# Altium schematic sheet rf_router_swrmet.SchDoc: mcHF Pro Transceiver RF board
size A3; Author: Krassi Atanassov; CompanyName: MØNKA; Engineer: For radio amateurs experimentation, non-commercial use only. Thank you!; Revision: 0.8.2; SheetTotal: 14
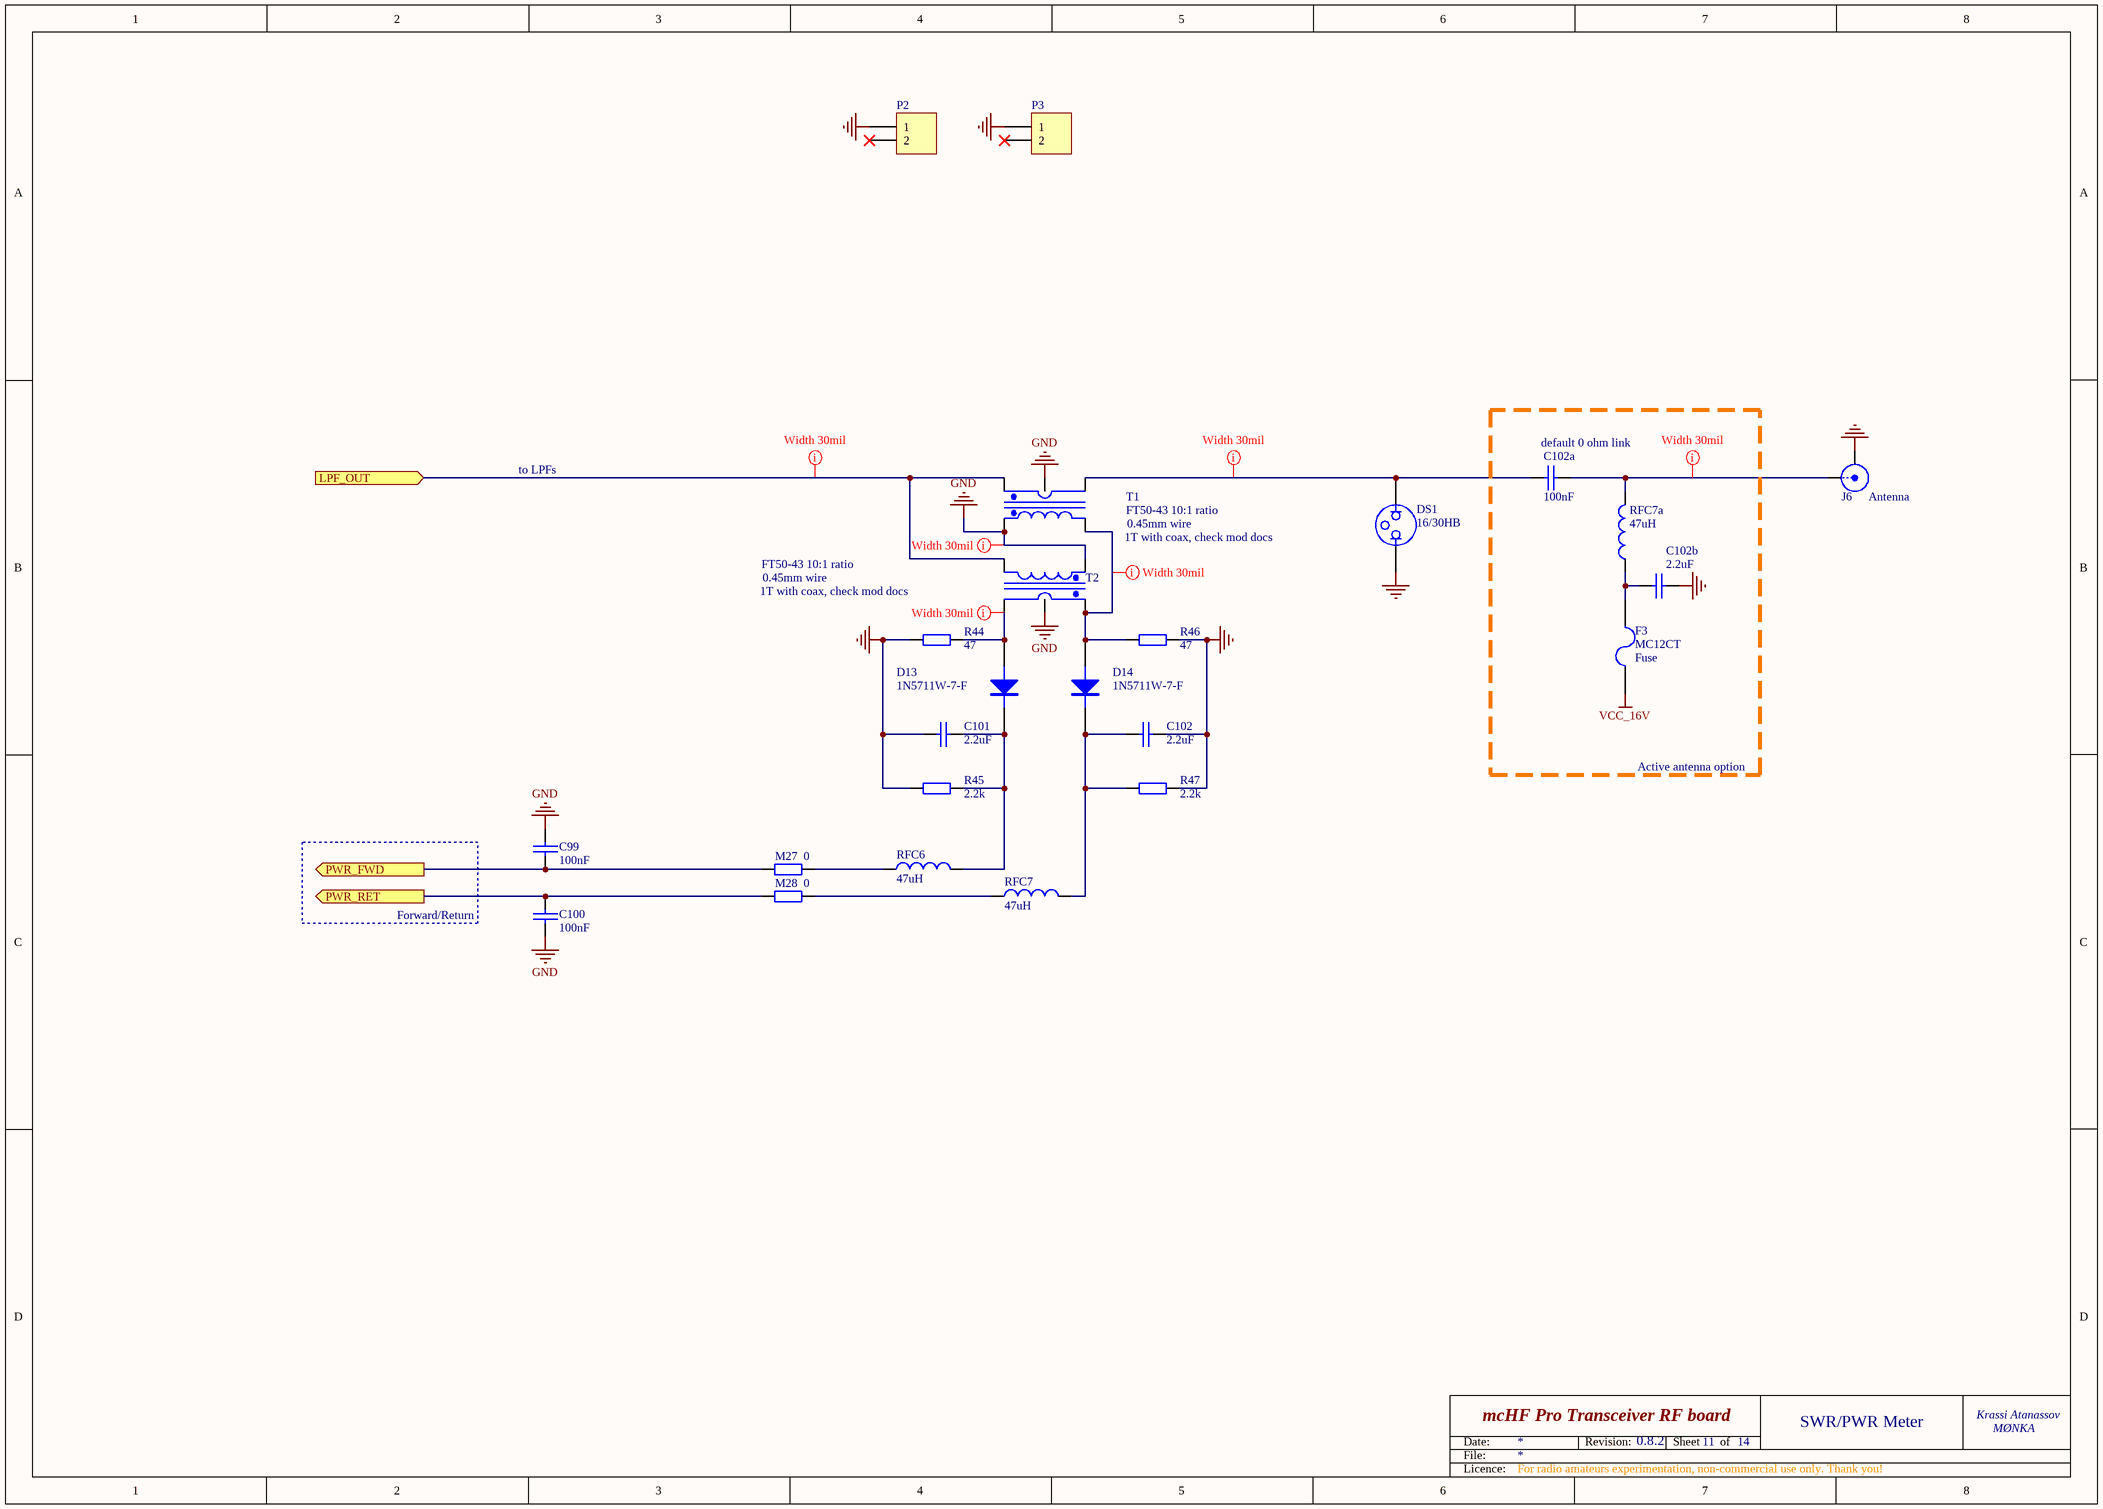
[diagram p0: rf_router_swrmet.SchDoc]

## Parts
C99  100nF  [0805]
C100  100nF  [0805]
C101  2.2uF  [0805]
C102  2.2uF  [0805]
C102a  100nF  [0805]  (no BOM)
C102b  2.2uF  [0805]  (no BOM)
D13  1N5711W-7-F  [SOD87]
D14  1N5711W-7-F  [SOD87]
DS1  16/30HB  [NEON]
F3  MC12CT  [1206]  (no BOM)
J6  Antenna  [BNC_RA CON]
M27  0  [0805]
M28  0  [0805]
P2  Header 2  [SIP2]  (value not drawn)
P3  Header 2  [SIP2]  (value not drawn)
R44  47  [0805]
R45  2.2k  [0805]
R46  47  [0805]
R47  2.2k  [0805]
RFC6  47uH  [0805]
RFC7  47uH  [0805]
RFC7a  47uH  [0805]  (no BOM)
T1  FT50-43 10:1 ratio  [SWR_TR _new]
T2  FT50-43 10:1 ratio  [SWR_TR _new]

## Ports
LPF_OUT (in), PWR_FWD (out), PWR_RET (out)

## Nets
GND: C99.1 C100.2 C101.1 C102.2 C102b.2 DS1.1 J6.2(Y) P2.1 P3.1 R44.1 R45.1 R46.2 R47.2 T1.1(Pri+) T1.5(Shield) T2.1(Pri+) T2.5(Shield)
VCC_16V: F3.2
LPF_OUT: T1.3(Sec+) T2.2(Pri-) ; port LPF_OUT
PWR_FWD: C99.2 M27.2 ; port PWR_FWD
PWR_RET: C100.1 M28.2 ; port PWR_RET
NetC101_2: C101.2 D13.2(K) R45.2 RFC6.2
NetC102_1: C102.1 D14.2(K) R47.1 RFC7.2
NetC102a_1: C102a.1 J6.1(X) RFC7a.2
NetC102a_2: C102a.2 DS1.2 T1.4(Sec-)
NetC102b_1: C102b.1 F3.1 RFC7a.1
NetD13_1: D13.1(A) R44.2 T2.4(Sec-)
NetD14_1: D14.1(A) R46.1 T1.2(Pri-) T2.3(Sec+)
NetM27_1: M27.1 RFC6.1
NetM28_1: M28.1 RFC7.1

Not connected (* = marked no-connect by the designer): P2 2*; P3 2*

## Layout directives
rule Width Constraint [Pref Width = 30mil    Min Width = 30mil    Max Width = 30mil]: GND, LPF_OUT, NetC102a_1, NetC102a_2, NetD13_1, NetD14_1

## Notes on the sheet
- (near C102a) default 0 ohm link
- to LPFs
- 0.45mm wire
- 1T with coax, check mod docs
- (near R44) 1T with coax, check mod docs
- Active antenna option
- Forward/Return
- 11
- SWR/PWR Meter
- Date:
- File:
- Revision:
- Sheet
- of
- Licence:

## Library data of the parts
C99 C100 = CAP: Capacitor; QT Order: QCC-00154; Price: 0.068
C101 C102 C102b = CAP: Capacitor; QT Order: QCC-00103; Price: 0.115
C102a = CAP: Capacitor; Voltage: 100V; QT Order: QCC-00154; Price: 0.068
D13 D14 = PMEG6010CEH: RF DIODE SCHOTTKY 70V, SOD-123F; Order: DK 1N5711W-FDITR-ND; QT Order: QCD-00034; Price: 0.085
DS1 = 16/30HB: NEON LAMP, WIRE ENDED, T2; Notes: post assembly; Price: 0.243
F3 = Fuse: QT Order: QCI-00216; Price: 0.134; Function: Fuse
J6 = BNC: RF COAXIAL, BNC, JACK; Notes: post assembly; Price: 0.69
M27 M28 = RES: Resistor; QT Order: QCR-00268; Price: 0.009
P2 P3 = Header 2: Header, 2-Pin
R44 R46 = RES: Resistor; QT Order: QCR-00293; Price: 0.052
R45 R47 = RES: Resistor; QT Order: QCR-00333; Price: 0.046
RFC6 RFC7 RFC7a = TDK-NLV25T: INDUCTOR, SIGNAL LINE, 47UH, 1005; Price: 0.166
T1 T2 = SWR_TR: SWR Bridge transformer; Notes: post assembly; Price: 0.795